# Altium schematic sheet Sheet2.SchDoc
size A; SheetNumber: 2; SheetTotal: 2
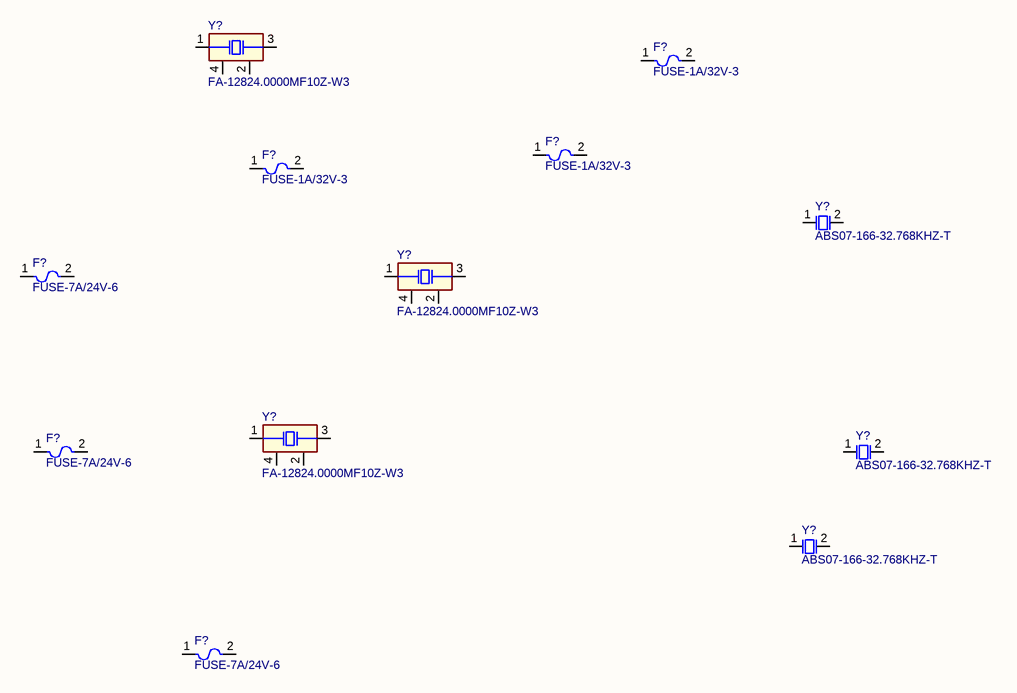
[diagram p0: Sheet2.SchDoc]

## Parts
(Parts that share a designator on the sheet are numbered #1, #2 ... from top to bottom, then left to right.)
F?#1  FUSE-1A/32V-3  [LFUS-467_V]
F?#2  FUSE-1A/32V-3  [LFUS-467_V]
F?#3  FUSE-1A/32V-3  [LFUS-467_V]
F?#4  FUSE-7A/24V-6  [LFUS-466_V]
F?#5  FUSE-7A/24V-6  [LFUS-466_V]
F?#6  FUSE-7A/24V-6  [LFUS-466_V]
Y?#1  FA-12824.0000MF10Z-W3  [EPSON-FA-128_V]
Y?#2  ABS07-166-32.768KHZ-T  [EPSON-FC-135_V]
Y?#3  FA-12824.0000MF10Z-W3  [EPSON-FA-128_V]
Y?#4  FA-12824.0000MF10Z-W3  [EPSON-FA-128_V]
Y?#5  ABS07-166-32.768KHZ-T  [EPSON-FC-135_V]
Y?#6  ABS07-166-32.768KHZ-T  [EPSON-FC-135_V]

## Nets

Not connected (* = marked no-connect by the designer): F?#1 1 2; F?#2 1 2; F?#3 1 2; F?#4 1 2; F?#5 1 2; F?#6 1 2; Y?#1 1(X1) 2(NC) 3(X2) 4(NC); Y?#2 1 2; Y?#3 1(X1) 2(NC) 3(X2) 4(NC); Y?#4 1(X1) 2(NC) 3(X2) 4(NC); Y?#5 1 2; Y?#6 1 2

## Library data of the parts
F?#1-F?#3 = CMP-005-00012-1: Fast Acting Fuse, 1 A, 32 V, -55 to 90 degC, 2-Pin SMD, RoHS, Tape and Reel; Current Rating: 1A; Case/Package: LFUS-467; Pins: 2
F?#4-F?#6 = CMP-005-00010-1: Surface Mount Fuses 7A 24V VFA SLIMLINE; Current Rating: 7A; Pins: 2
Y?#1 Y?#3 Y?#4 = CMP-003-00028-1: Crystal, 24 MHz, +/- 10 ppm, -20 to 75 degC, 4-Pin SMD, RoHS, Tape and Reel; Load Capacitance: 12pF; Frequency: 24MHz; ESR: 80; Mounting Technology: SMT; Pins: 4; Case/Package: SMD/SMT; Min Operating Temperature: -20°C; RoHS Compliant: Yes; Max Operating Temperature: 75°C
Y?#2 Y?#5 Y?#6 = CMP-003-00029-1: Crystal 32.768kHz 10ppm 7pF -40C +85C; Pins: 2; Frequency: 32.768kHz